# EAGLE design das_netzteil (EAGLE 5.07)
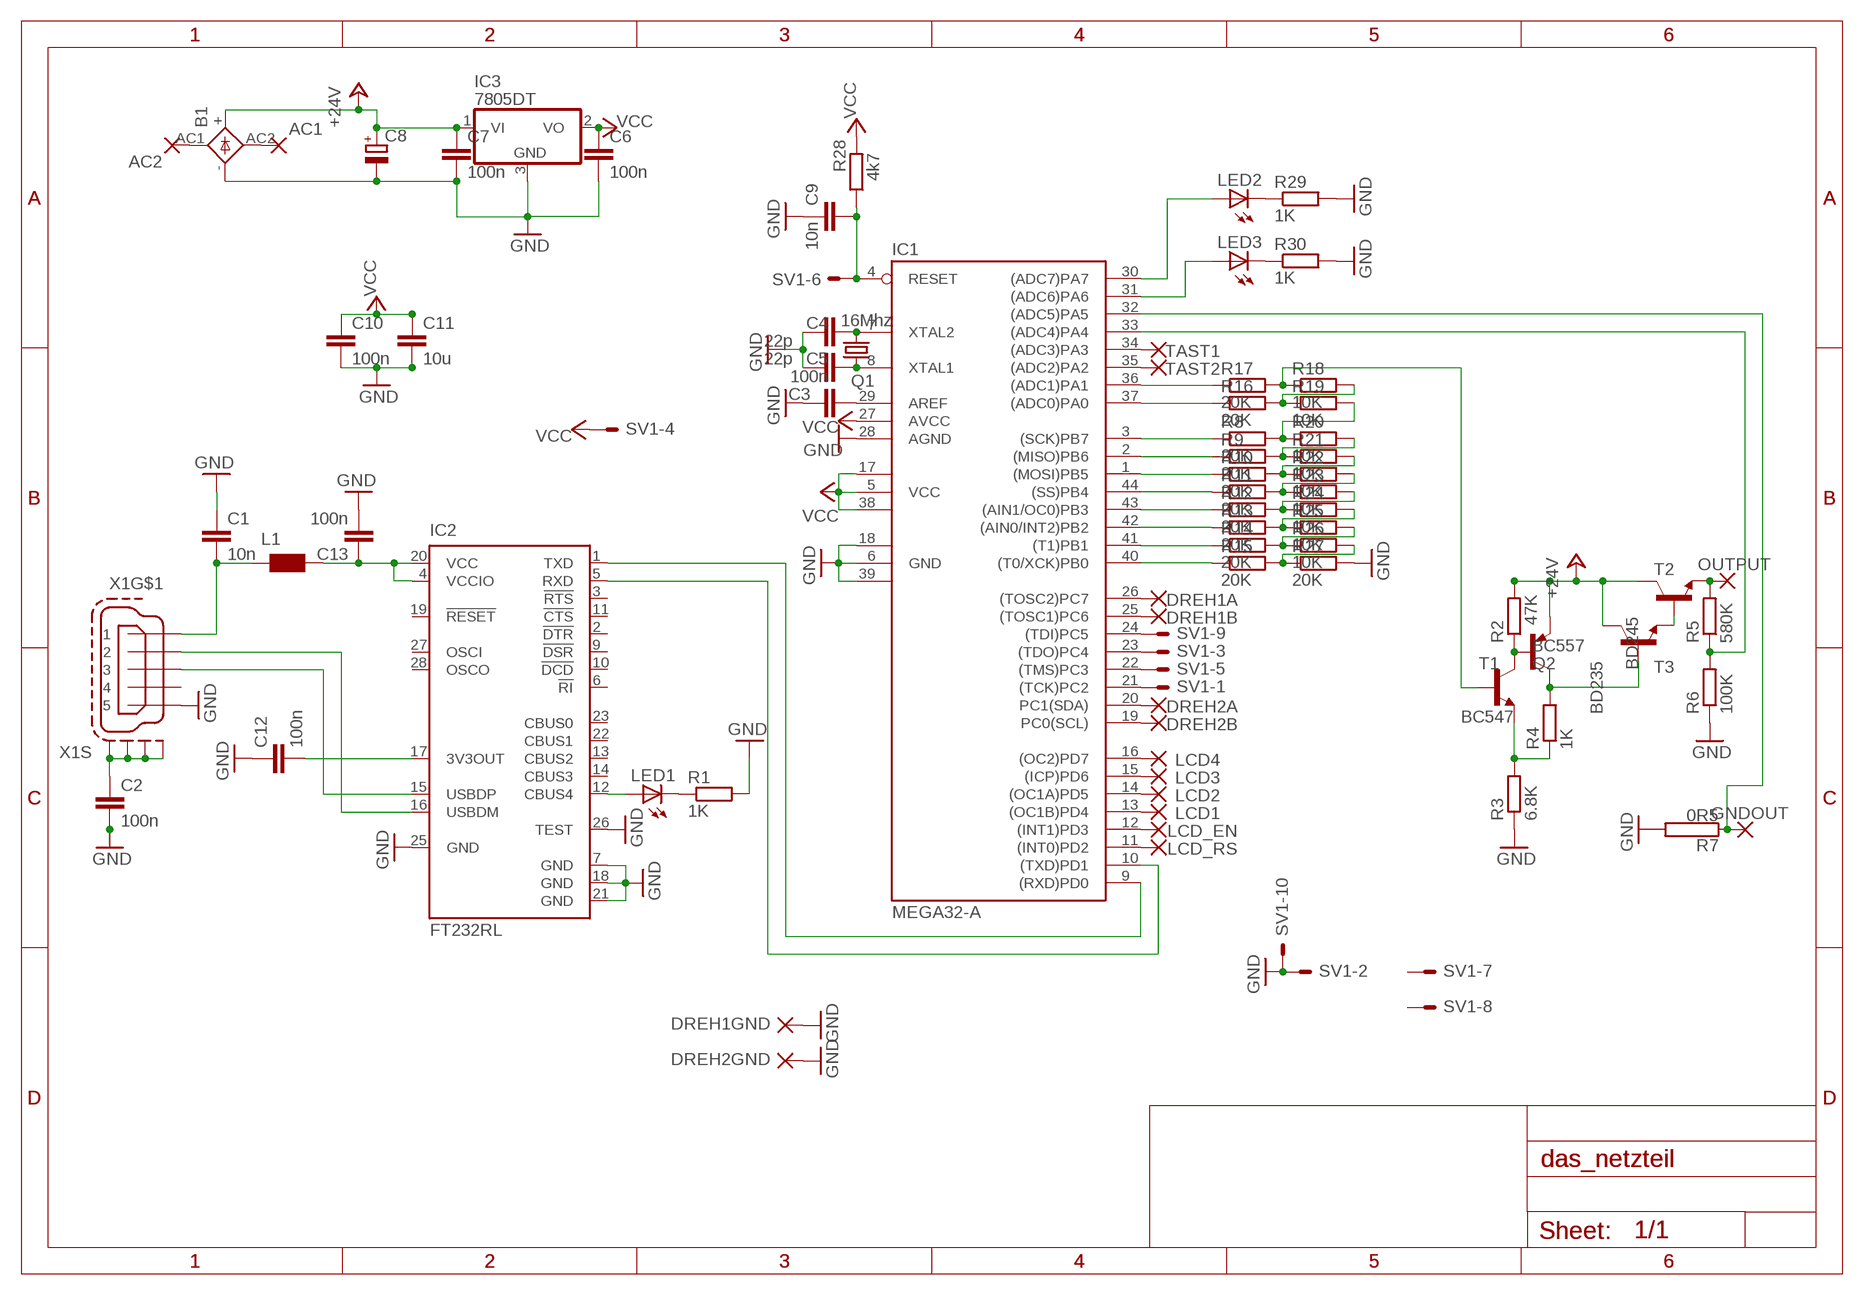
[diagram p0: schematic, sheet 1]

## Parts
AC1  SMD5  [SMD2,54-5,08]
AC2  SMD5  [SMD2,54-5,08]
B1  KBU  [KBU]
C1  10n  C-EUC1206K  [C1206K]
C2  100n  C-EUC1206K  [C1206K]
C3  100n  C-EUC1206K  [C1206K]
C4  22p  C-EUC1206K  [C1206K]
C5  22p  C-EUC1206K  [C1206K]
C6  100n  C-EUC1206K  [C1206K]
C7  100n  C-EUC1206K  [C1206K]
C8  CPOL-EUE7.5-18  [E7,5-18]
C9  10n  C-EUC1206K  [C1206K]
C10  100n  C-EUC1206K  [C1206K]
C11  10u  C-EUC1206K  [C1206K]
C12  100n  C-EUC1206K  [C1206K]
C13  100n  C-EUC1206K  [C1206K]
DREH1A  SMD2  [SMD1,27-2,54]
DREH1B  SMD2  [SMD1,27-2,54]
DREH1GND  SMD2  [SMD1,27-2,54]
DREH2A  SMD2  [SMD1,27-2,54]
DREH2B  SMD2  [SMD1,27-2,54]
DREH2GND  SMD2  [SMD1,27-2,54]
GNDOUT  SMD5  [SMD2,54-5,08]
IC1  MEGA32-A  [TQFP44]
IC2  FT232RL  [SSOP28]
IC3  7805DT  [TO252]
L1  WE-CBF_1206  [1206]
LCD1  SMD2  [SMD1,27-2,54]
LCD2  SMD2  [SMD1,27-2,54]
LCD3  SMD2  [SMD1,27-2,54]
LCD4  SMD2  [SMD1,27-2,54]
LCD_EN  SMD2  [SMD1,27-2,54]
LCD_RS  SMD2  [SMD1,27-2,54]
LED1  LY_T679-D2E2-1  [PLCC2]
LED2  LY_T679-D2E2-1  [PLCC2]
LED3  LY_T679-D2E2-1  [PLCC2]
OUTPUT  SMD5  [SMD2,54-5,08]
Q1  16Mhz  CRYSTALHC49U-V  [HC49U-V]
Q2  BC557  [TO92]
R1  1K  R-EU_M1206  [M1206]
R2  47K  R-EU_M1206  [M1206]
R3  6.8K  R-EU_M1206  [M1206]
R4  1K  R-EU_M1206  [M1206]
R5  580K  R-EU_M1206  [M1206]
R6  100K  R-EU_M1206  [M1206]
R7  0R5  RKH214-8  [KH214-8]
R8  20K  R-EU_M1206  [M1206]
R9  20K  R-EU_M1206  [M1206]
R10  20K  R-EU_M1206  [M1206]
R11  20K  R-EU_M1206  [M1206]
R12  20K  R-EU_M1206  [M1206]
R13  20K  R-EU_M1206  [M1206]
R14  20K  R-EU_M1206  [M1206]
R15  20K  R-EU_M1206  [M1206]
R16  20K  R-EU_M1206  [M1206]
R17  20K  R-EU_M1206  [M1206]
R18  10K  R-EU_M1206  [M1206]
R19  10K  R-EU_M1206  [M1206]
R20  10K  R-EU_M1206  [M1206]
R21  10K  R-EU_M1206  [M1206]
R22  10K  R-EU_M1206  [M1206]
R23  10K  R-EU_M1206  [M1206]
R24  10K  R-EU_M1206  [M1206]
R25  10K  R-EU_M1206  [M1206]
R26  10K  R-EU_M1206  [M1206]
R27  20K  R-EU_M1206  [M1206]
R28  4k7  R-EU_M1206  [M1206]
R29  1K  R-EU_M1206  [M1206]
R30  1K  R-EU_M1206  [M1206]
SV1  ML10LE  [ML10L]
T1  BC547  [TO92]
T2  BD245  -NPN-SOT93V  [SOT93V]
T3  BD235  -NPN-TO126V  [TO126V]
TAST1  SMD2  [SMD1,27-2,54]
TAST2  SMD2  [SMD1,27-2,54]
X1  MINI-USB-SCHIELD-32005-201  [32005-201]

## Nets
+24V: B1.+ C7.1 C8.+ IC3.1(VI) Q2.1(E) R2.2 T2.C T3.2(C)
GND: B1.- C1.1 C2.2 C3.1 C4.1 C5.1 C6.2 C7.2 C8.- C9.1 C10.2 C11.2 C12.1 C13.2 DREH1GND.1(P) DREH2GND.1(P) IC1.6(GND) IC1.18(GND1) IC1.28(AGND) IC1.39(GND2) IC2.7(GND) IC2.18(GND) IC2.21(GND) IC2.25(GND) IC2.26(TEST) IC3.3(GND) R1.2 R3.1 R6.1 R7.2 R27.2 R29.2 R30.2 SV1.2 SV1.10 X1.5
N$1: IC1.9((RXD)PD0) IC2.1(TXD)
N$2: IC1.10((TXD)PD1) IC2.5(RXD)
N$3: C13.1 IC2.4(VCCIO) IC2.20(VCC) L1.2
N$4: C1.2 L1.1 X1.1
N$5: IC2.16(USBDM) X1.2
N$6: IC2.15(USBDP) X1.3
N$7: C2.1 X1.M1(S:S1) X1.M2(S:S2) X1.M3(S:S3) X1.M4(S:S4)
N$8: IC2.12(CBUS4) LED1.A
N$9: LED1.C R1.1
N$10: C4.2 IC1.7(XTAL2) Q1.2
N$11: C3.2 IC1.29(AREF)
N$12: C5.2 IC1.8(XTAL1) Q1.1
N$13: Q2.2(B) R2.1 T1.3(C)
N$14: R3.2 R4.1 T1.1(E)
N$15: Q2.3(C) R4.2 T3.3(B)
N$16: GNDOUT.1(P) IC1.32((ADC5)PA5) R7.1
N$17: T2.B T3.1(E)
N$19: IC1.36((ADC1)PA1) R17.1
N$20: OUTPUT.1(P) R5.2 T2.E
N$21: IC1.33((ADC4)PA4) R5.1 R6.2
N$22: IC1.37((ADC0)PA0) R16.1
N$23: IC1.3((SCK)PB7) R8.1
N$24: IC1.2((MISO)PB6) R9.1
N$25: IC1.1((MOSI)PB5) R10.1
N$26: IC1.44((SS)PB4) R11.1
N$27: IC1.43((AIN1/OC0)PB3) R12.1
N$28: IC1.42((AIN0/INT2)PB2) R13.1
N$29: IC1.41((T1)PB1) R14.1
N$30: R14.2 R25.2 R26.1
N$31: R17.2 R18.1 T1.2(B)
N$32: R16.2 R18.2 R19.1
N$33: R8.2 R19.2 R20.1
N$34: R9.2 R20.2 R21.1
N$35: R10.2 R21.2 R22.1
N$36: R11.2 R22.2 R23.1
N$37: R12.2 R23.2 R24.1
N$38: R13.2 R24.2 R25.1
N$39: IC1.23((TDO)PC4) SV1.3
N$40: R15.2 R26.2 R27.1
N$41: IC1.40((T0/XCK)PB0) R15.1
N$42: IC1.22((TMS)PC3) SV1.5
N$43: IC1.24((TDI)PC5) SV1.9
N$44: IC1.21((TCK)PC2) SV1.1
N$45: AC1.1(P) B1.AC2
N$47: AC2.1(P) B1.AC1
N$48: IC1.16((OC2)PD7) LCD4.1(P)
N$49: IC1.15((ICP)PD6) LCD3.1(P)
N$50: IC1.14((OC1A)PD5) LCD2.1(P)
N$51: IC1.13((OC1B)PD4) LCD1.1(P)
N$52: IC1.12((INT1)PD3) LCD_EN.1(P)
N$53: IC1.11((INT0)PD2) LCD_RS.1(P)
N$54: DREH1A.1(P) IC1.26((TOSC2)PC7)
N$55: DREH1B.1(P) IC1.25((TOSC1)PC6)
N$56: DREH2A.1(P) IC1.20(PC1(SDA))
N$57: DREH2B.1(P) IC1.19(PC0(SCL))
N$58: IC1.35((ADC2)PA2) TAST2.1(P)
N$59: IC1.34((ADC3)PA3) TAST1.1(P)
N$60: C9.2 IC1.4(RESET) R28.1 SV1.6
N$61: LED2.C R29.1
N$62: LED3.C R30.1
N$63: IC1.30((ADC7)PA7) LED2.A
N$64: IC1.31((ADC6)PA6) LED3.A
N$67: C12.2 IC2.17(3V3OUT)
VCC: C6.1 C10.1 C11.1 IC1.5(VCC) IC1.17(VCC1) IC1.27(AVCC) IC1.38(VCC2) IC3.2(VO) R28.2 SV1.4
Unconnected: IC2.2(!DTR) IC2.3(!RTS) IC2.6(!RI) IC2.9(!DSR) IC2.10(!DCD) IC2.11(!CTS) IC2.13(CBUS2) IC2.14(CBUS3) IC2.19(!RESET) IC2.22(CBUS1) IC2.23(CBUS0) IC2.27(OSCI) IC2.28(OSCO) SV1.7 SV1.8 X1.4

## Library data of the parts
AC1 AC2 GNDOUT OUTPUT = wirepad:SMD5: SMD PAD
B1 = rectifier:KBU: DIOTEC RECTIFIER
C1-C7 C9-C13 = rcl:C-EU: CAPACITOR, European symbol
C8 = rcl:CPOL-EU: POLARIZED CAPACITOR, European symbol
DREH1A DREH1B DREH1GND DREH2A DREH2B DREH2GND LCD1-LCD4 LCD_EN LCD_RS TAST1 TAST2 = wirepad:SMD2: SMD PAD
IC1 = atmel:MEGA32: MICROCONTROLLER 32 Kbytes FLASH 2 Kbytes SRAM 1 Kbytes EEPROM USART 8-channel 10 bit ADC Source: www.atmel.com .. doc2503.pdf
IC2 = ftdichip:FT232R: Source: http://www.ftdichip.com/Documents/DataSheets/DS_FT232R_v104.pdf
IC3 = linear:78*: Positive VOLTAGE REGULATOR Source: http://cache.national.com/ds/LM/LM78L05.pdf http://www.fairchildsemi.com/ds/LM/LM7805.pdf
L1 = wuerth-elektronik:WE-CBF: SMD EMI Suppression Ferrite Beads - excellent anti-EMI properties - low DCR - impedances till 3000 ohms - rated current up to 6 A
LED1-LED3 = led:*_T679-?-1: LC TOPLED® Low Current LED Source: http://catalog.osram-os.com .. LG_LS_LY_T679_OBS.pdf; COLOR: yellow
Q1 = crystal:CRYSTAL: CRYSTAL
Q2 = transistor-pnp:BC557: PNP Transistor
R1-R6 R8-R30 = rcl:R-EU_: RESISTOR, European symbol
R7 = resistor-power:R: Power Resitor
SV1 = con-ml:ML10LE: HARTING
T1 = transistor-neu-to92:BC547: NPN TRANSISTOR
T2 T3 = transistor:*-NPN-: NPN Transistror BF959 corrected 2008.03.06
X1 = con-cypressindustries:MINI-USB-SCHIELD-: MINI USB-B Conector Source: www.cypressindustries.com

## Board
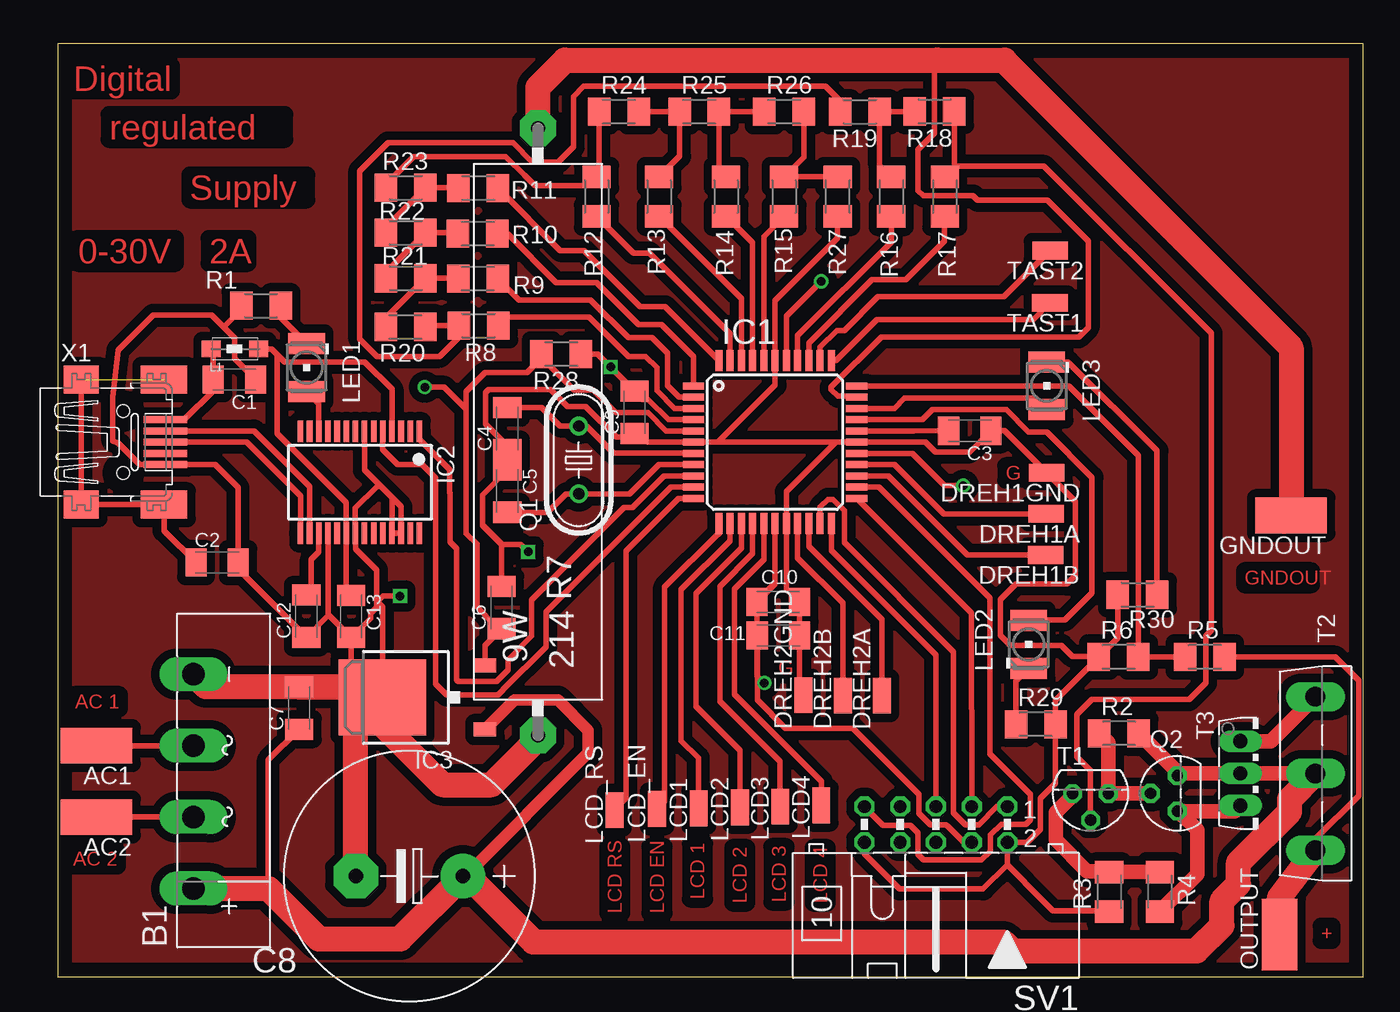
[diagram p1: board, top side]
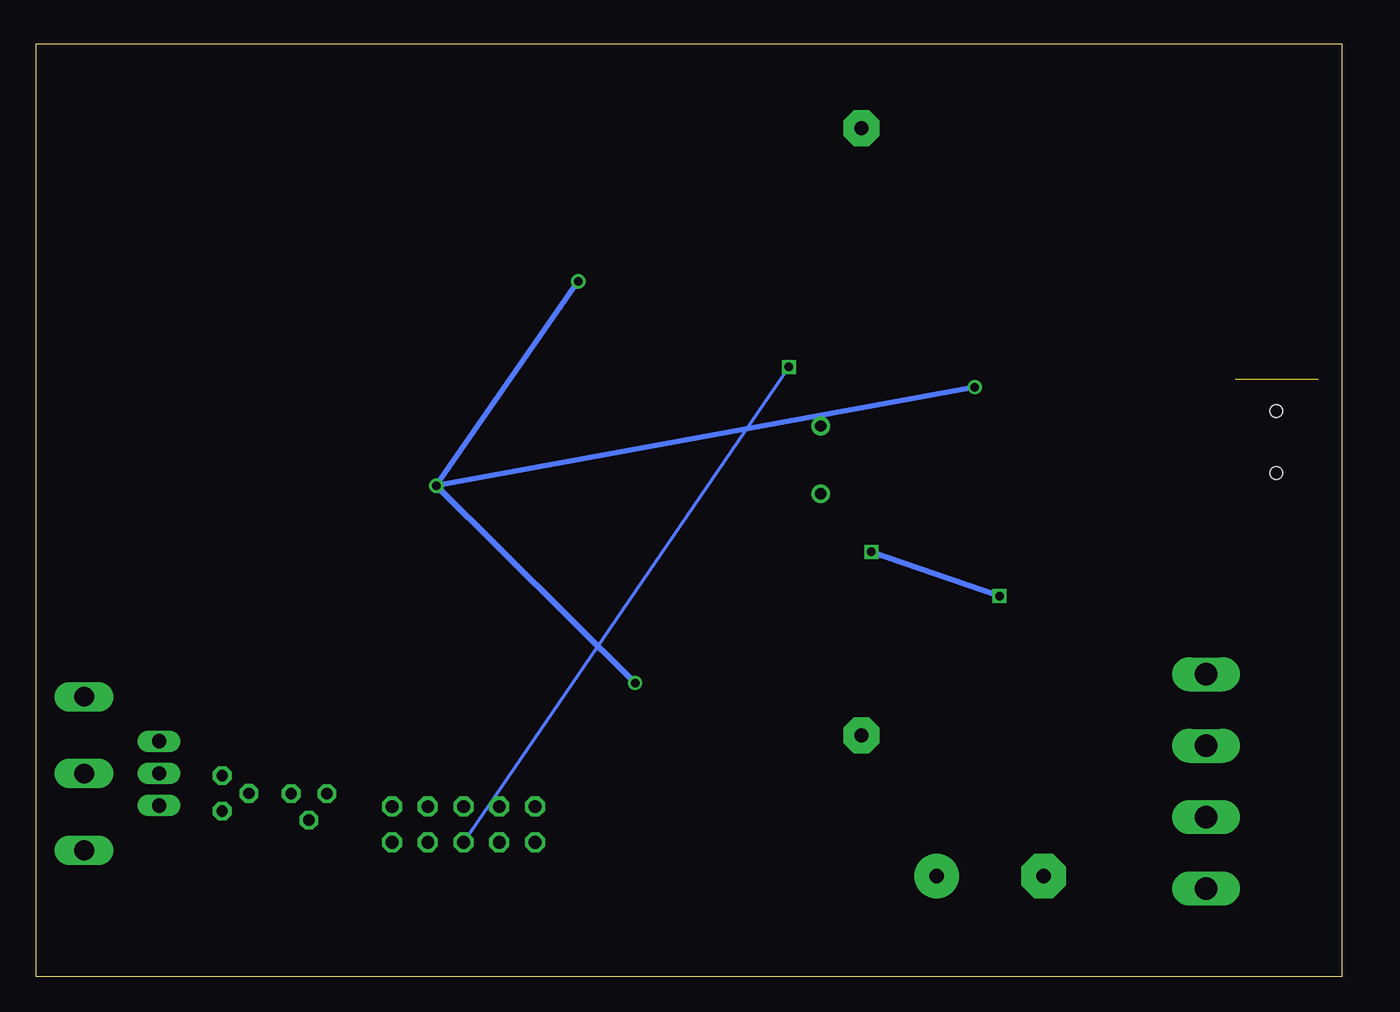
[diagram p2: board, bottom side, seen from below]

Size 92.87 x 66.38 mm. Coordinates in mm from the lower left corner, seen from the top.
Outline: 0.01,0 92.87,0.01 92.86,66.37 0,66.38 0.01,0
Copper layers (1*16): Top 0.035mm / dielectric 1.5mm / Bottom 0.035mm
Design rules "default": minimum track width 10mil, minimum drill 24mil, track to track 8mil, track to pad 8mil, pad to pad 8mil, via to via 8mil, smd to smd 8mil, copper to edge 40mil, drill to drill 8mil, minimum pad ring 10mil, minimum via ring 8mil, stop-mask expansion 4mil, vias tented up to drill 0mil, thermal gap 10mil

### Footprints (pad centres in the part's own frame; a part is rotated, then mirrored left to right if it is on the bottom)
SMD2,54-5,08 = smd 2.54 x 5.08: 1 0,0
KBU = drill 1.6 long: + -7.62,2.54; - 7.62,2.54; AC1 -2.54,2.54; AC2 2.54,2.54
C1206K = smd 1.5 x 2: 1 -1.5,0; 2 1.5,0
E7,5-18 = drill 1.016 pad 3.15 round: + -3.81,0 | drill 1.016 pad 3.15 octagon: - 3.81,0
SMD1,27-2,54 = smd 1.27 x 2.54: 1 0,0
TQFP44 = smd 1.5 x 0.5: 1 -5.8,4; 2 -5.8,3.2; 3 -5.8,2.4; 4 -5.8,1.6; 5 -5.8,0.8; 6 -5.8,0; 7 -5.8,-0.8; 8 -5.8,-1.6; 9 -5.8,-2.4; 10 -5.8,-3.2; 11 -5.8,-4; 23 5.8,-4; 24 5.8,-3.2; 25 5.8,-2.4; 26 5.8,-1.6; 27 5.8,-0.8; 28 5.8,0; 29 5.8,0.8; 30 5.8,1.6; 31 5.8,2.4; 32 5.8,3.2; 33 5.8,4 | smd 0.5 x 1.5: 12 -4,-5.8; 13 -3.2,-5.8; 14 -2.4,-5.8; 15 -1.6,-5.8; 16 -0.8,-5.8; 17 0,-5.8; 18 0.8,-5.8; 19 1.6,-5.8; 20 2.4,-5.8; 21 3.2,-5.8; 22 4,-5.8; 34 4,5.8; 35 3.2,5.8; 36 2.4,5.8; 37 1.6,5.8; 38 0.8,5.8; 39 0,5.8; 40 -0.8,5.8; 41 -1.6,5.8; 42 -2.4,5.8; 43 -3.2,5.8; 44 -4,5.8
SSOP28 = smd 0.4 x 1.5: 1 -4.225,-3.625; 2 -3.575,-3.625; 3 -2.925,-3.625; 4 -2.275,-3.625; 5 -1.625,-3.625; 6 -0.975,-3.625; 7 -0.325,-3.625; 8 0.325,-3.625; 9 0.975,-3.625; 10 1.625,-3.625; 11 2.275,-3.625; 12 2.925,-3.625; 13 3.575,-3.625; 14 4.225,-3.625; 15 4.225,3.625; 16 3.575,3.625; 17 2.925,3.625; 18 2.275,3.625; 19 1.625,3.625; 20 0.975,3.625; 21 0.325,3.625; 22 -0.325,3.625; 23 -0.975,3.625; 24 -1.625,3.625; 25 -2.275,3.625; 26 -2.925,3.625; 27 -3.575,3.625; 28 -4.225,3.625
TO252 = smd 1 x 1.6: 1 -2.28,-4.8; 2 2.28,-4.8 | smd 5.4 x 6.2: 3 0,2.5
1206 = smd 1.35 x 1.2: 1 -1.7,0; 2 1.65,0
PLCC2 = smd 2.6 x 1.5: A 0,1.7; C 0,-1.7
HC49U-V = drill 0.813 round: 1 -2.413,0; 2 2.413,0
TO92 = drill 0.813 octagon: 1 1.27,0; 2 0,1.905; 3 -1.27,0
M1206 = smd 1.6 x 2: 1 -1.4,0; 2 1.4,0
KH214-8 = drill 1.016 pad 2.54 octagon: 1 -21.59,0; 2 21.59,0
ML10L = drill 0.914 octagon: 1 -5.08,-1.27; 2 -5.08,1.27; 3 -2.54,-1.27; 4 -2.54,1.27; 5 0,-1.27; 6 0,1.27; 7 2.54,-1.27; 8 2.54,1.27; 9 5.08,-1.27; 10 5.08,1.27
SOT93V = drill 1.397 long: B -5.461,-2.54; C 0,-2.54; E 5.461,-2.54
TO126V = drill 1.016 long: 1 -2.286,-1.27; 2 0,-1.27; 3 2.286,-1.27
32005-201 = smd 3.1 x 0.5: 1 3,1.6; 2 3,0.8; 3 3,0; 4 3,-0.8; 5 3,-1.6 | smd 2.5 x 2: M1 -3,-4.45; M2 -3,4.45 | smd 3.3 x 2: M3 2.9,4.45; M4 2.9,-4.45 | hole 0.9: 0,2.2; 0,-2.2

### Placement (x,y rotation side)
AC1  2.77,16.44 90 top
AC2  2.77,11.36 90 top
B1  12.2,13.9 90 top
C1  12.57,42.48 180 top
C2  11.34,29.46 0 top
C3  64.87,38.84 180 top
C4  31.98,38.98 90 top
C5  31.98,34.54 270 top
C6  31.57,26.25 90 top
C7  17.18,19.11 90 top
C8  25.01,7.16 180 top
C9  41.03,40.15 90 top
C10  51.24,26.65 0 top
C11  51.25,24.27 0 top
C12  17.69,25.65 90 top
C13  20.87,25.63 270 top
DREH1A  70.3,32.93 90 top
DREH1B  70.26,30 90 top
DREH1GND  70.33,35.85 90 top
DREH2A  58.62,19.99 0 top
DREH2B  55.84,20 0 top
DREH2GND  53.03,20.02 0 top
GNDOUT  87.72,32.81 90 top
IC1  51.03,38.03 0 top
IC2  21.5,35.17 180 top
IC3  25.59,19.86 90 top
L1  12.63,44.66 0 top
LCD1  45.6,11.97 0 top
LCD2  48.53,12.04 0 top
LCD3  51.39,12.1 0 top
LCD4  54.3,12.19 0 top
LCD_EN  42.63,11.94 0 top
LCD_RS  39.6,11.85 0 top
LED1  17.71,43.34 180 top
LED2  69.05,23.64 0 top
LED3  70.34,42.03 180 top
OUTPUT  86.9,3.02 0 top
Q1  37.06,36.76 90 top
Q2  79.63,13.05 90 top
R1  14.46,47.73 180 top
R2  75.48,17.32 0 top
R3  74.78,6.04 90 top
R4  78.39,6.05 270 top
R5  81.59,22.75 0 top
R6  75.44,22.75 0 top
R7  34.16,38.76 270 top
R8  29.94,46.31 180 top
R9  29.89,49.66 180 top
R10  29.87,52.87 180 top
R11  29.91,56.09 180 top
R12  38.33,55.49 90 top
R13  42.77,55.49 90 top
R14  47.54,55.49 90 top
R15  51.66,55.49 90 top
R16  59.28,55.49 90 top
R17  63.09,55.49 90 top
R18  62.37,61.55 180 top
R19  57.06,61.52 180 top
R20  24.74,46.22 180 top
R21  24.76,49.68 180 top
R22  24.76,52.92 180 top
R23  24.75,56.12 180 top
R24  39.92,61.52 0 top
R25  45.63,61.52 0 top
R26  51.66,61.52 0 top
R27  55.47,55.49 270 top
R28  35.81,44.29 180 top
R29  69.56,17.96 0 top
R30  76.8,27.18 180 top
SV1  62.46,10.83 180 top
T1  73.45,13.03 180 top
T2  91.98,14.46 270 top
T3  85.38,14.47 270 top
TAST1  70.56,47.94 90 top
TAST2  70.58,51.65 90 top
X1  4.67,38.03 0 top

### Tracks (layer width: path | path; a pad name or v marks a point on that pad's centre or on a via)
+24V
  Top 0.406: 17.52,17.61 C7.1 14.98,15.42 14.98,6.28 | 37.73,17.53 37.73,15.94 28.85,7.06
  Top 0.813: C8.+ 28.98,7.16 37.73,15.91 37.73,17.53 35.58,19.68 32.48,19.68 IC3.1
  Top 1.016: R2.2 79.63,14.57 Q2.1 79.78,14.47 T3.2 T2.C
  Top 1.778: B1.+ 14.98,6.28 18.56,2.7 24.36,2.7 C8.+ | 28.85,7.06 29.25,7.06 33.84,2.47 67.24,2.47 67.89,1.83 80.99,1.83 82.79,3.63 82.79,5.39 83.98,6.58 83.98,8.11 87.61,11.74 87.61,12.63 T2.C
GND  (via drill 0.6 pad 0.61)
  Top 0.406: C9.1 41.93,38.03 IC1.6 46.97,38.03 | C5.1 C4.1 31.7,37.48 | C2.2 12.83,34.8 11.2,36.43 X1.5 5.83,36.43 4.3,37.96 3.92,38.11 3.91,39.39 3.91,41.22 4.3,44.58 6.78,47.05 10.95,47.05 11.79,46.22 | C2.2 | IC2.7 21.83,36.03 24.42,33.43 IC2.26 IC2.25 | IC2.25 24.07,31.55 24.07,31.54 23.97,31.54 | IC2.25 23.77,34.08 22.98,34.88 22.71,34.88 21.17,33.33 IC2.21 21.18,30.44 22.67,28.94 22.67,26.59 | 22.67,26.59 22.67,26.26 22.25,25.83 22.25,25.5 C13.2 | C2.2 12.83,29 C12.1 19.22,25.68 IC2.18 19.22,25.77 C13.2 | C13.2 20.87,22.08 IC3.3 | C7.2 22.35,20.61 IC3.3 | IC3.3 23.09,26.32 22.7,26.71 22.7,27.4 | IC1.28 55.35,38.03 51.83,34.51 IC1.18 51.83,27.57 C10.2 52.74,24.28 C11.2 52.75,20.3 DREH2GND.1 | 46.97,38.03 51.02,42.08 IC1.39 51.03,48.08 55.46,52.52 R27.2 | 46.97,38.03 IC1.28 | IC3.3 23.42,19.54 | IC1.28 61.72,38.03 62.42,37.33 64.86,37.33 C3.1 67.35,38.84 DREH1GND.1 72.38,33.81 72.38,28.53 71.78,27.94 68.16,27.94 67.06,26.83 67.06,24.29 67.77,23.58 71.39,23.58 72.18,22.79 74.01,22.79 R6.1 | 67.54,7.96 SV1.2 67.56,9.55 68.95,9.55 69.89,10.48 69.89,12.69 70.96,13.76 R29.2 70.96,19.66 R6.1 | 67.54,7.96 68.78,6.72 68.78,6.69 70.79,4.68 74.73,4.68 R3.1 | C9.1 40.82,38.86 | 11.79,46.22 12.59,45.42 12.59,43.96 C1.1 | R1.2 13.06,47.49 11.79,46.22 | C5.1 31.98,37.33 31.93,37.38 31.61,37.38 31.61,36.01 31.77,35.85 31.77,37.97 30.43,39.31 30.43,41.55 30.66,41.78 35.07,41.78 36.28,40.57 37.55,40.57 39.74,38.38 40.76,38.38 C9.1 | C6.2 31.57,30.78 30.49,31.85 30.49,31.86 30.21,32.14 | 30.21,32.14 30.21,34.27 C5.1 | 30.21,32.14 30.21,32.11 31.56,30.76 32.92,30.76 v33.46,30.22
  Top 0.406: v24.35,27.08 23.16,27.08 22.67,26.59 | R30.2 75.39,24.1 R6.1 | SV1.10 57.38,8.73 59.88,6.24 65.82,6.24 67.54,7.96
  Top 1.778: R7.2 34.16,16.95 30.87,13.66 27.37,13.66 23.01,18.02 23.01,19.78 IC3.3 21.2,17.97 C8.- | C7.2 22.94,20.61 22.96,20.63 10.55,20.63 B1.-
  Bottom 0.406: v24.35,27.08 v33.46,30.22
N$1
  Top 0.406: IC1.9 43.13,35.63 40.87,33.37 40.28,33.37 33.71,26.8 33.71,24.24 32.02,22.54 32.02,21.81 31.22,21.01 28.49,21.01 28.37,21.12 28.37,30.47 27.9,30.94 27.9,34.41 27.88,34.43 27.88,36.06 25.72,38.22 IC2.1
N$2
  Top 0.406: IC1.10 43.61,34.83 34.73,25.96 34.73,23.47 31.69,20.43 31.69,20.42 31.32,20.04 27.67,20.04 26.87,20.84 26.87,35.48 25.91,36.44 24.18,36.44 23.13,37.49 IC2.5
N$3
  Top 0.406: C13.1 20.52,27.47 IC2.20 20.52,33.73 15.63,38.63 15.63,44.2 15.65,44.22 | L1.2 15.21,44.66 15.65,44.22 | 15.65,44.22 16.15,43.72 21.84,43.72 23.77,41.79 IC2.4
N$4
  Top 0.406: X1.1 9.01,39.63 11.09,41.71 11.09,42.46 C1.2 11.07,44.52 L1.1
N$5
  Top 0.406: IC2.16 17.93,34.87 13.97,38.82 X1.2
N$6
  Top 0.406: IC2.15 17.27,34.2 13.44,38.03 X1.3
N$7  (1 unrouted)
  Top 0.406: C2.1 7.57,31.72 X1.M4 2.71,33.58 2.63,33.66 1.75,33.66 X1.M1 X1.M2
N$8
  Top 0.406: IC2.12 18.58,40.77 LED1.A
N$9
  Top 0.406: R1.1 15.86,46.88 LED1.C
N$10
  Top 0.406: IC1.7 39.55,37.24 37.61,39.17 Q1.2 35.72,39.17 34.4,40.49 C4.2
N$11
  Top 0.406: IC1.29 60.87,38.83 C3.2
N$12
  Top 0.406: IC1.8 42.76,36.42 40.68,34.35 Q1.1 36.17,34.35 34.85,33.03 31.99,33.03 C5.2
N$13
  Top 1.016: Q2.2 77.71,13.03 T1.3 74.72,16.68 R2.1
N$14
  Top 1.016: R4.1 74.79,7.45 R3.2 74.7,7.51 73.19,7.51 70.97,9.73 70.97,11.68 72.18,12.89 T1.1
N$15
  Top 1.016: T3.3 83.71,11.78 Q2.3 79.7,11.78 81.04,10.44 81.04,7.3 R4.2
N$16
  Top 0.406: IC1.32 56.77,41.29 55.49,41.29 55.01,41.77 55.01,41.94 58.58,45.5 72.62,45.5 73.29,46.18 73.29,52.33 70.4,55.22 65.42,55.22 65.09,55.55 61.57,55.55 61.2,55.93 61.2,58.84 62.34,59.99 62.34,65 62.54,65.2
  Top 1.778: R7.1 34.16,63.27 36.08,65.2 62.54,65.2 67.36,65.2 67.36,65.1 87.72,44.75 GNDOUT.1
N$17
  Top 1.016: T3.1 86.27,16.75 T2.B
N$18
  pour Top (isolate 0.61): 0.16,66.24 92.77,66.24 92.77,0.14 0.23,0.14 0.23,4.53
N$19
  Top 0.406: IC1.36 53.43,45.08 57.92,49.58 60.33,49.58 63.07,52.32 63.07,54.07 R17.1
N$20
  Top 0.406: T2.E 89.44,9.8 92.52,12.88 92.52,21.09 90.88,22.74 R5.2
  Top 1.778: OUTPUT.1 86.9,5.62 T2.E
N$21
  Top 0.406: R5.1 R6.2 76.84,37.08 71.9,42.02 IC1.33
N$22
  Top 0.406: IC1.37 52.63,45.61 59.28,52.27 R16.1
N$23
  Top 0.406: IC1.3 43.87,40.43 42.61,41.69 42.61,43.33 41.82,44.11 40.6,44.11 39.42,45.29 | 39.42,45.29 | 39.42,45.29 37.78,46.93 31.96,46.93 R8.1
N$24
  Top 0.406: IC1.2 44.18,41.23 43.36,42.05 43.36,44.34 42.26,45.45 40.59,45.45 37.9,48.13 32.82,48.13 R9.1
N$25
  Top 0.406: IC1.1 45.23,44.1 42.95,46.37 41.3,46.37 39.48,48.19 39.48,48.21 38.31,49.38 35.44,49.38 31.98,52.84 31.3,52.84 R10.1
N$26
  Top 0.406: IC1.44 43.2,47.65 41.43,47.65 37.42,51.66 35.74,51.66 R11.1
N$27
  Top 0.406: IC1.43 47.83,45.73 42.09,51.47 40.95,51.47 R12.1
N$28
  Top 0.406: IC1.42 48.63,48.24 R13.1
N$29
  Top 0.406: IC1.41 49.43,52.2 R14.1
N$30
  Top 0.406: R26.1 R25.2 47.03,57.4 R14.2
N$31
  Top 0.406: T1.2 73.45,14.68 72.5,15.63 72.5,18.66 73.55,19.72 80.47,19.72 81.64,20.89 81.64,24.24 82.05,24.65 82.03,24.66 82.03,45.77 70.15,57.65 63.85,57.65 R17.2 63.77,57.56 R18.1
N$32
  Top 0.406: R18.2 58.48,61.55 R19.1 58.46,57.71 R16.2
N$33
  Top 0.406: R20.1 26.22,46.31 R8.2 28.54,45.49 27.17,44.12 22.71,44.12 21.48,45.36 21.48,57.3 23.5,59.32 32.38,59.32 33.75,57.95 35.6,57.95 36.68,59.03 36.68,62.6 37.4,63.33 54.59,63.33 55.69,62.23 55.69,61.55 R19.2
N$34
  Top 0.406: R9.2 28.48,49.68 R21.1 23.34,46.86 R20.2
N$35
  Top 0.406: R10.2 28.42,52.92 R22.1 23.36,50.12 R21.2
N$36
  Top 0.406: R11.2 28.49,56.12 R23.1 23.36,53.33 R22.2
N$37
  Top 0.406: R24.1 38.52,57.08 R12.2 37.7,56.26 33.95,56.26 33.2,57.01 | R23.2 23.35,56.37 25.33,58.34 31.87,58.34 33.2,57.01 | 33.2,57.01
N$38
  Top 0.406: R24.2 R25.1 44.23,58.35 R13.2
N$39
  Top 0.406: SV1.3 65,25.86 IC1.23
N$40
  Top 0.406: R26.2 53.06,58.29 R15.2 R27.1
N$41
  Top 0.406: IC1.40 50.23,52.66 R15.1
N$42
  Top 0.406: SV1.5 62.46,22.89 55.04,30.31 55.04,32.21 IC1.22
N$43
  Top 0.406: 56.84,34.84 IC1.24 58.39,34.83 66.28,26.94 66.28,15.84 69.17,12.96 69.17,11.17 68.85,10.85 67.1,10.85 66.33,10.08 66.33,8.93 65.7,8.31 61.57,8.31 61.18,8.69 61.18,10.23 60.63,10.77 58.69,10.77 57.38,12.08 SV1.9
N$44
  Top 0.406: SV1.1 66.81,12.1 65.51,10.81 64.57,10.81 63.71,11.66 63.71,15.88 63.7,15.87 63.7,23.12 55.94,30.89 55.94,33.16 55.15,33.95 54.77,33.95 54.23,33.41 IC1.21
N$45
  Top 0.406: AC1.1 B1.AC2
N$47
  Top 0.406: AC2.1 B1.AC1
N$48
  Top 0.406: IC1.16 50.23,29.68 48.45,27.9 | 48.45,27.9 | 48.45,27.9 48.12,27.58 48.12,20.08 54.3,13.9 LCD4.1
N$49
  Top 0.406: IC1.15 49.43,30.1 47.09,27.76 47.09,19.59 51.36,15.32 51.36,12.13 LCD3.1
N$50
  Top 0.406: IC1.14 48.63,30.5 46.29,28.17 | 46.29,28.17 | 46.29,28.17 45.4,27.27 45.4,19.25 48.53,16.11 LCD2.1
N$51
  Top 0.406: IC1.13 47.83,31 47.81,31 44.35,27.54 44.35,16.79 45.56,15.57 45.56,12.01 LCD1.1
N$52
  Top 0.406: IC1.12 47.03,31.5 46.96,31.5 43.16,27.71 43.16,12.48 LCD_EN.1
N$53
  Top 0.406: IC1.11 44.16,34.03 40.42,30.28 40.42,12.67 LCD_RS.1
N$54
  Top 0.406: IC1.26 59.5,36.43 63.02,32.91 70.28,32.91 DREH1A.1
N$55
  Top 0.406: IC1.25 59.08,35.63 64.71,30 DREH1B.1
N$56
  Top 0.406: IC1.20 53.43,30.6 58.62,25.41 DREH2A.1
N$57
  Top 0.406: IC1.19 52.63,29.79 55.84,26.58 DREH2B.1
N$58
  Top 0.406: IC1.35 54.23,44.78 55.41,45.96 55.94,45.96 58.35,48.36 67.29,48.36 TAST2.1
N$59
  Top 0.406: IC1.34 55.34,43.83 58.26,46.75 69.38,46.75 TAST1.1
N$60  (via drill 0.6)
  Top 0.254: IC1.4 43.45,39.63 | 43.45,39.63 | 43.45,39.63 41.66,41.42 40.61,41.42 40.53,41.5 40.53,42.01 40.59,42.08 40.59,42.11 v39.33,43.37
  Top 0.406: IC1.4 43.44,39.63 42,41.07 41.61,41.07 C9.2 38.39,44.29 R28.1
  Bottom 0.254: SV1.6 v39.33,43.37
N$61
  Top 0.406: R29.1 68.16,21.05 LED2.C
N$62
  Top 0.406: LED3.C 71.86,43.73 78.17,37.41 78.17,27.2 R30.1
N$63
  Top 0.406: IC1.30 61.5,39.63 62.19,40.33 67.46,40.33 69.04,38.74 70.34,38.74 73.56,35.52 73.56,27.31 71.64,25.39 69.1,25.39 LED2.A
N$64
  Top 0.406: IC1.31 59.5,40.43 60.21,41.15 69.52,41.15 LED3.A
N$67
  Top 0.406: IC2.17 18.58,30.21 18.04,29.67 18.04,27.49 C12.2
VCC  (via drill 0.6 pad 0.61)
  Top 0.406: SV1.4 64.45,9.56 63.26,10.75 63.19,10.82 62.06,10.82 61.23,11.64 61.23,12.99 56.54,17.68 51.77,17.68 49.75,19.69 C11.1 49.74,24.28 C10.1 51.03,27.94 IC1.17 51.03,28 49.75,26.72 49.75,21.4 v50.26,20.89 | IC1.5 43.28,38.83 41.99,40.12 39.7,40.12 38.08,41.74 36.72,41.74 34.41,44.05 R28.2 34.48,44.37 34.48,44.24 34.45,44.24 34.31,44.1 34.31,43.9 33.37,42.96 33.36,42.97 30.4,42.97 29.04,41.61 29.04,40.38 | C6.1 30.96,24.75 | IC3.2 30.39,23.58 C6.1 | C6.1 31.57,24.83 31.45,24.95 31.15,24.95 29.81,26.29 29.81,30.78 29.04,31.55 29.04,40.38 | IC1.27 60.79,37.23 63.07,34.95 64.37,34.95 v64.4,34.92 | v26.11,41.94 27.49,41.94 29.04,40.38 | IC1.38 51.83,46.99 v54.3,49.46
  Bottom 0.406: v26.11,41.94 v64.4,34.92 | v64.4,34.92 v54.3,49.46 | v64.4,34.92 v50.26,20.89

### Text on the board
Top: Digital | regulated | Supply | 0-30V | 2A | G | GNDOUT | G | AC 1 | AC 2 | LCD 1 | LCD RS | LCD EN | LCD 2 | LCD 3 | LCD 4 | +